# Altium schematic sheet PostMUX_Filter.SchDoc
size A4; SheetNumber: 6; SheetTotal: 7
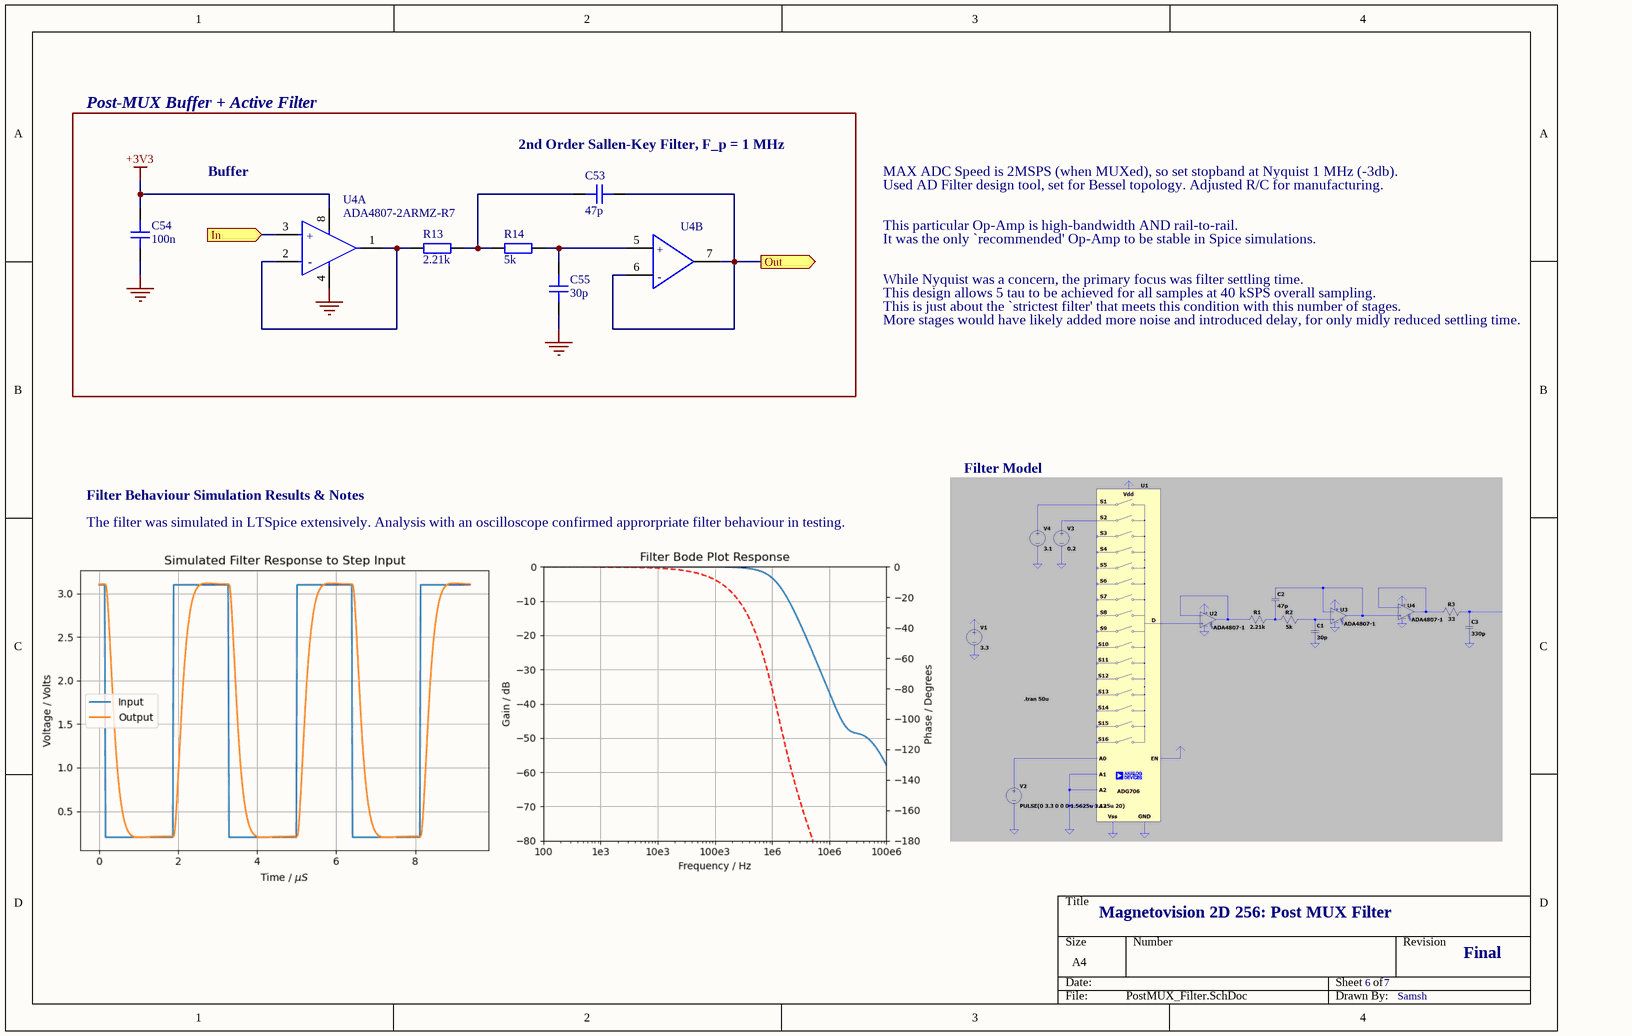
[diagram p0: PostMUX_Filter.SchDoc]

## Parts
C53  47p  [CAP_0603]
C54  100n  [CAP_0603]
C55  30p  [CAP_0603]
R13  2.21k  [RES_0603]
R14  5k  [RES_0603]
U4  ADA4807-2ARMZ-R7  [FP-RM-8-IPC_A]  (parts A,B of 2)

## Ports
In (in, see MUX_Block[4B]), Out (out, see MUX_Block[4C])

## Nets
+3V3: C54.2 U4.8(+VS)
GND: C54.1 C55.1 U4.4(-VS)
In: U4.3(+IN1) ; port In
Out: C53.2 U4.6(-IN2) U4.7(VOUT2) ; port Out
NetC53_1: C53.1 R13.1 R14.2
NetC55_2: C55.2 R14.1 U4.5(+IN2)
NetR13_2: R13.2 U4.1(VOUT1) U4.2(-IN1)

## Notes on the sheet
- Post-MUX Buffer + Active Filter
- Buffer
- (near C53) 2nd Order Sallen-Key Filter, F_p = 1 MHz
- MAX ADC Speed is 2MSPS (when MUXed), so set stopband at Nyquist 1 MHz (-3db).
- Used AD Filter design tool, set for Bessel topology. Adjusted R/C for manufacturing.
- This particular Op-Amp is high-bandwidth AND rail-to-rail.
- It was the only `recommended' Op-Amp to be stable in Spice simulations.
- While Nyquist was a concern, the primary focus was filter settling time.
- This design allows 5 tau to be achieved for all samples at 40 kSPS overall sampling.
- This is just about the `strictest filter' that meets this condition with this number of stages.
- More stages would have likely added more noise and introduced delay, for only midly reduced settling time.
- Filter Behaviour Simulation Results & Notes
- Filter Model
- The filter was simulated in LTSpice extensively. Analysis with an oscilloscope confirmed approrpriate filter behaviour in testing.
- Magnetovision 2D 256: Post MUX Filter
- 6
- 7
- Final
- Samsh
- (in symbol CMP-09116-000141-1, part A) +; -
- (in symbol CMP-09116-000141-1, part B) +; -

## Library data of the parts
C53-C55 = CMP-001-00085-1: Capacitor SMD 0603; Distributor Link: *; LCSC: *; Design Item ID: CAP_0603; Rating: *; Source: Schematic-Lib-PhilsLab.SchLib; Manufacturer Part Number: *; Manufacturer: *; Dielectric: *
R13 R14 = CMP-009-00179-1: Resistor SMD 0603; Manufacturer Part Number: *; Distributor Link: *; Source: Schematic-Lib-PhilsLab.SchLib; Manufacturer: *; Design Item ID: RES_0603; LCSC: *
U4 = CMP-09116-000141-1: IC OPAMP VFB 2 CIRCUIT 8MSOP; Operating Supply Current: 950uA; Input Bias Current: 1.2uA; Input Offset Voltage (Vos): 20uV; Power Supply Rejection Ratio (PSRR): 98dB; Max Dual Supply Voltage: 5V; Number of Circuits: 2; Min Dual Supply Voltage: 1.5V; Common Mode Rejection Ratio: 110dB; Output Current per Channel: 106mA; Slew Rate: 145V/µs; Max Supply Voltage: 10V; Voltage Gain: 130dB; Min Supply Voltage: 3V; -3db Bandwidth: 170MHz; Case/Package: MSOP; Lead Free: Contains Lead; Contact Plating: Tin; Max Operating Temperature: 125°C; Packaging: Tape and Reel; Number of Pins: 8; RoHS Compliant: Yes; Mount: Surface Mount; Min Operating Temperature: -40°C